# Altium schematic sheet S7CAS-PLEIADES-CARTE-MERE_P06_CLOCK.SchDoc
size Tabloid; SheetNumber: 10; SheetTotal: 18; Sheet_Name: CLOCK; Size: 11x17
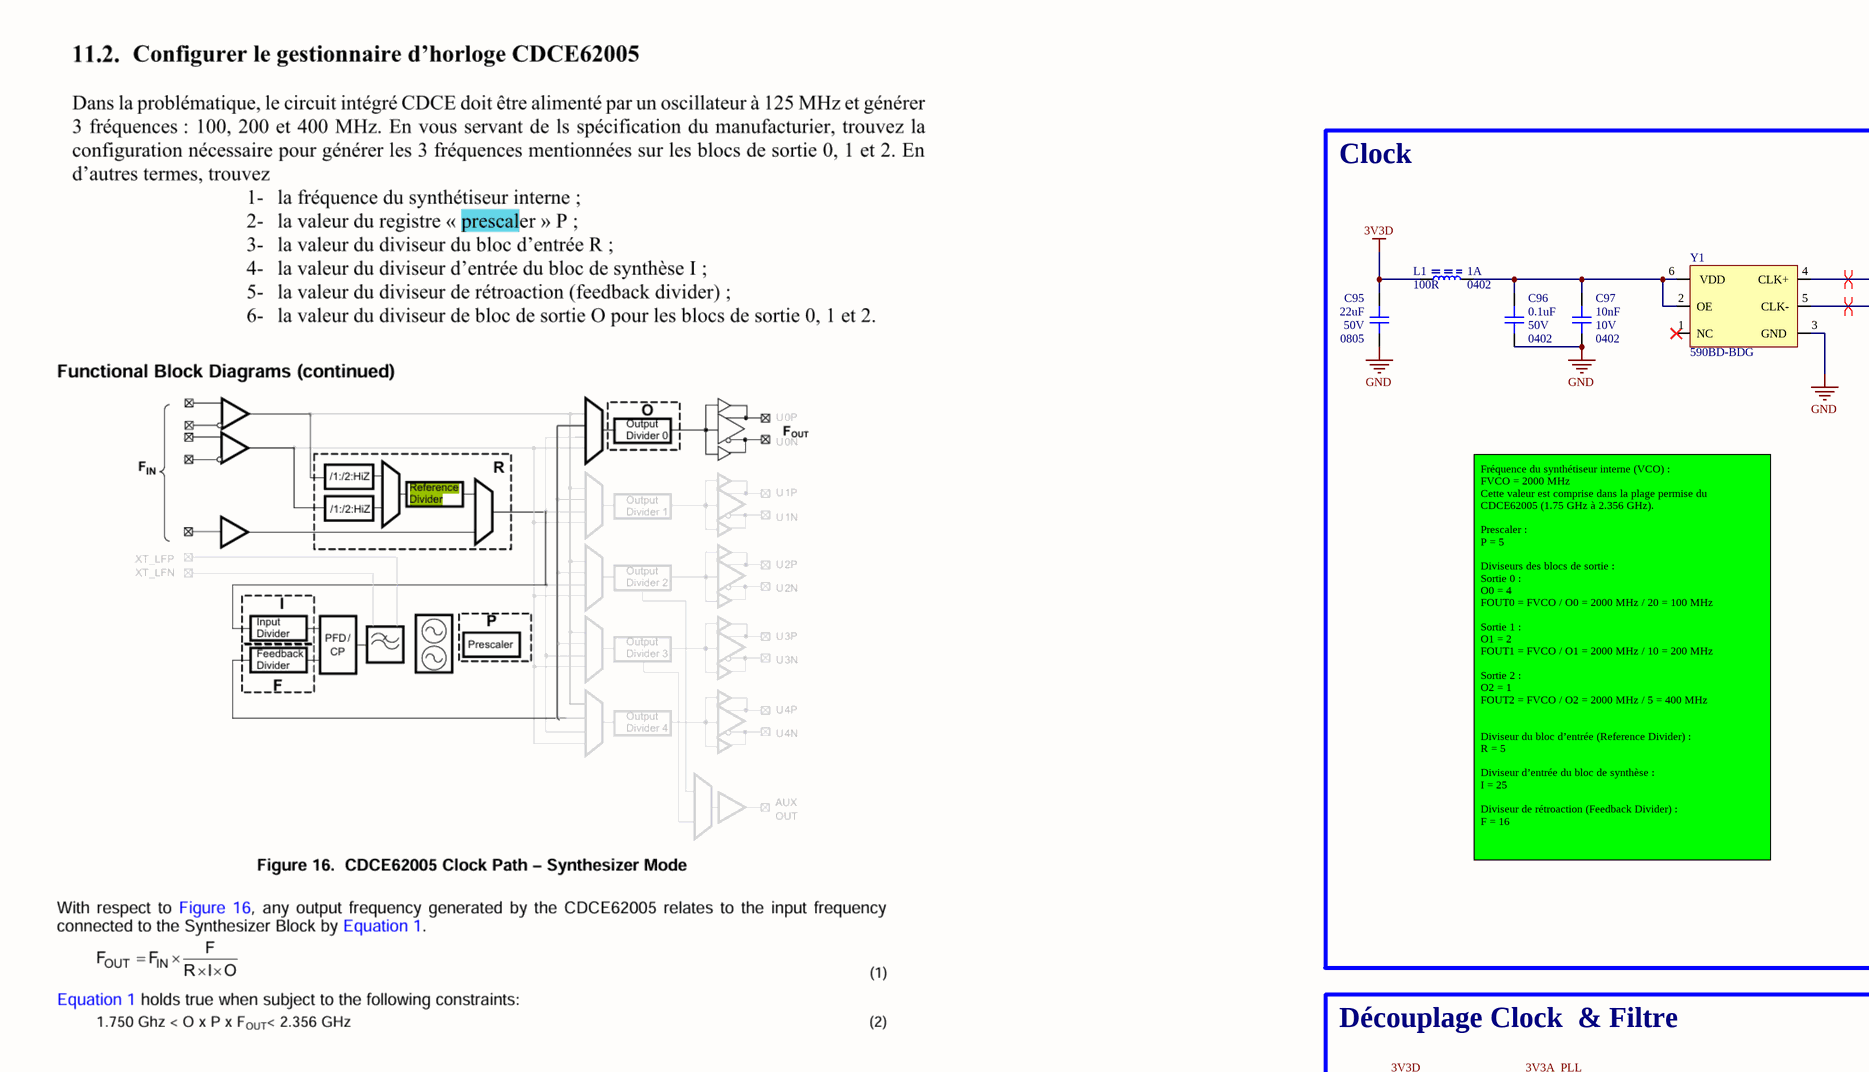
[diagram p0: S7CAS-PLEIADES-CARTE-MERE_P06_CLOCK.SchDoc, top left]
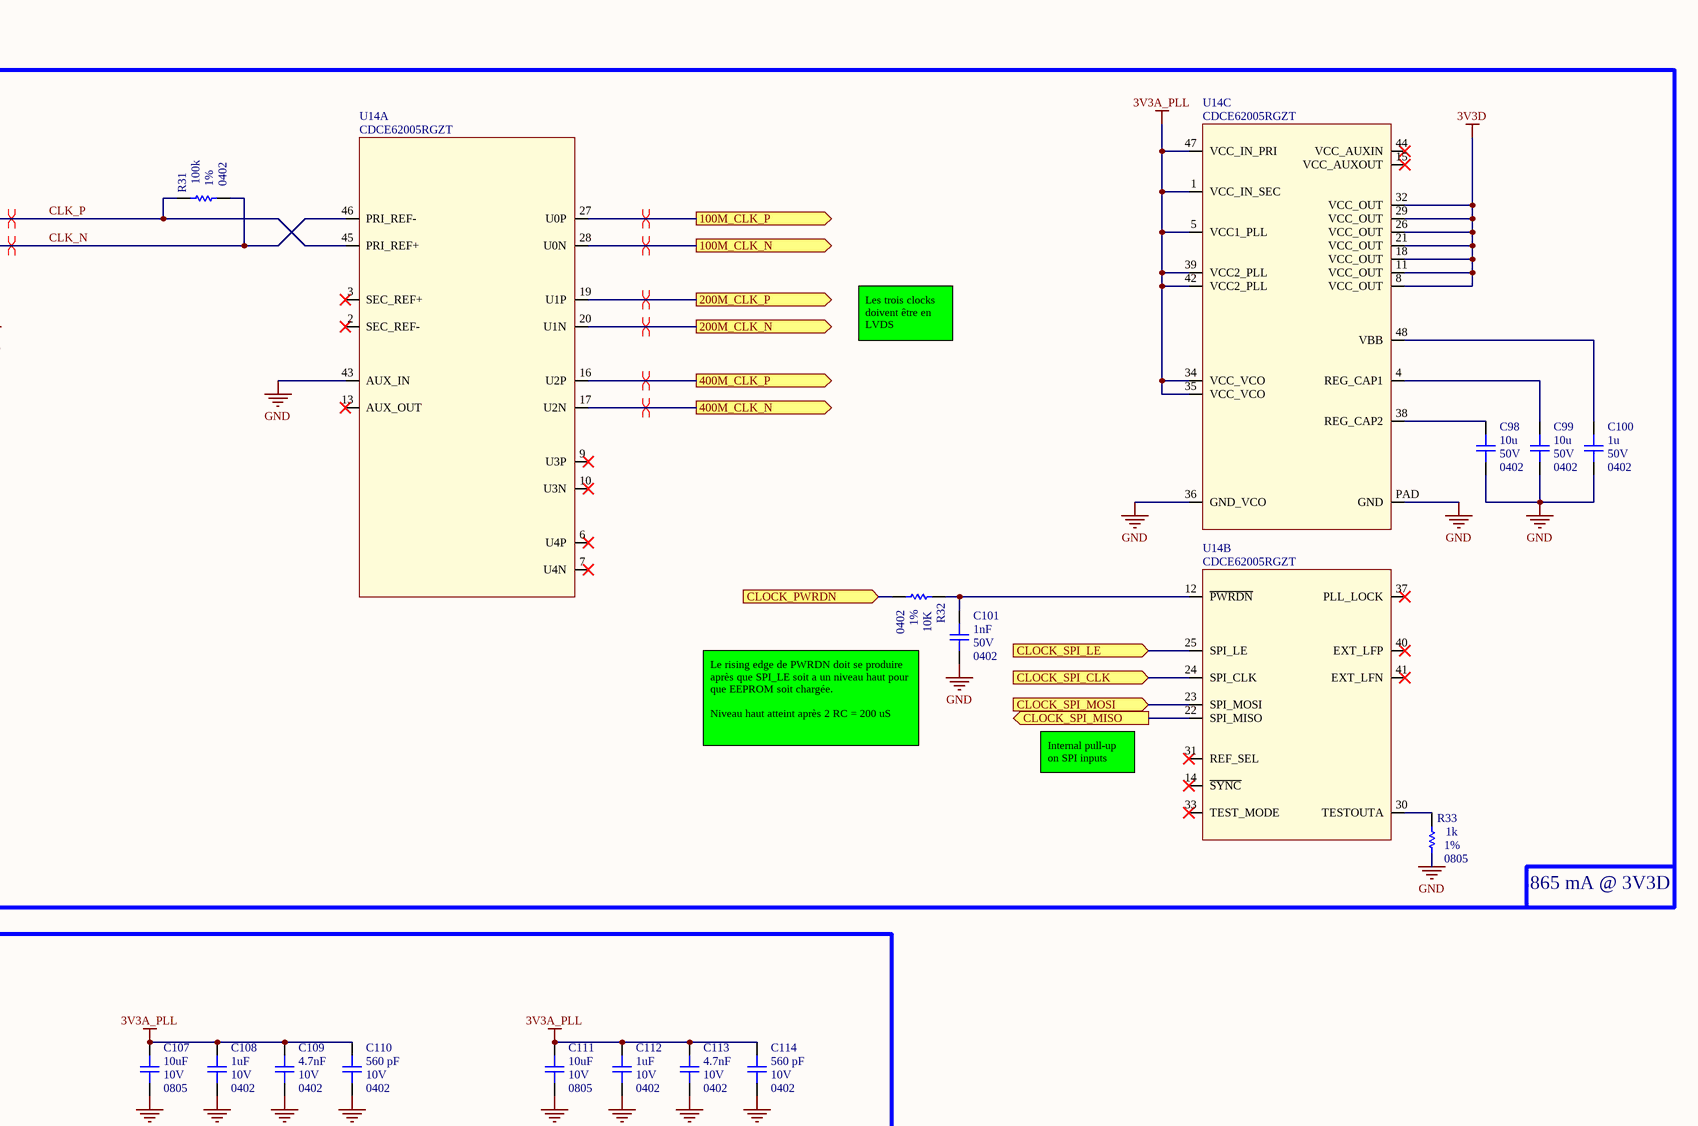
[diagram p1: S7CAS-PLEIADES-CARTE-MERE_P06_CLOCK.SchDoc, top middle]
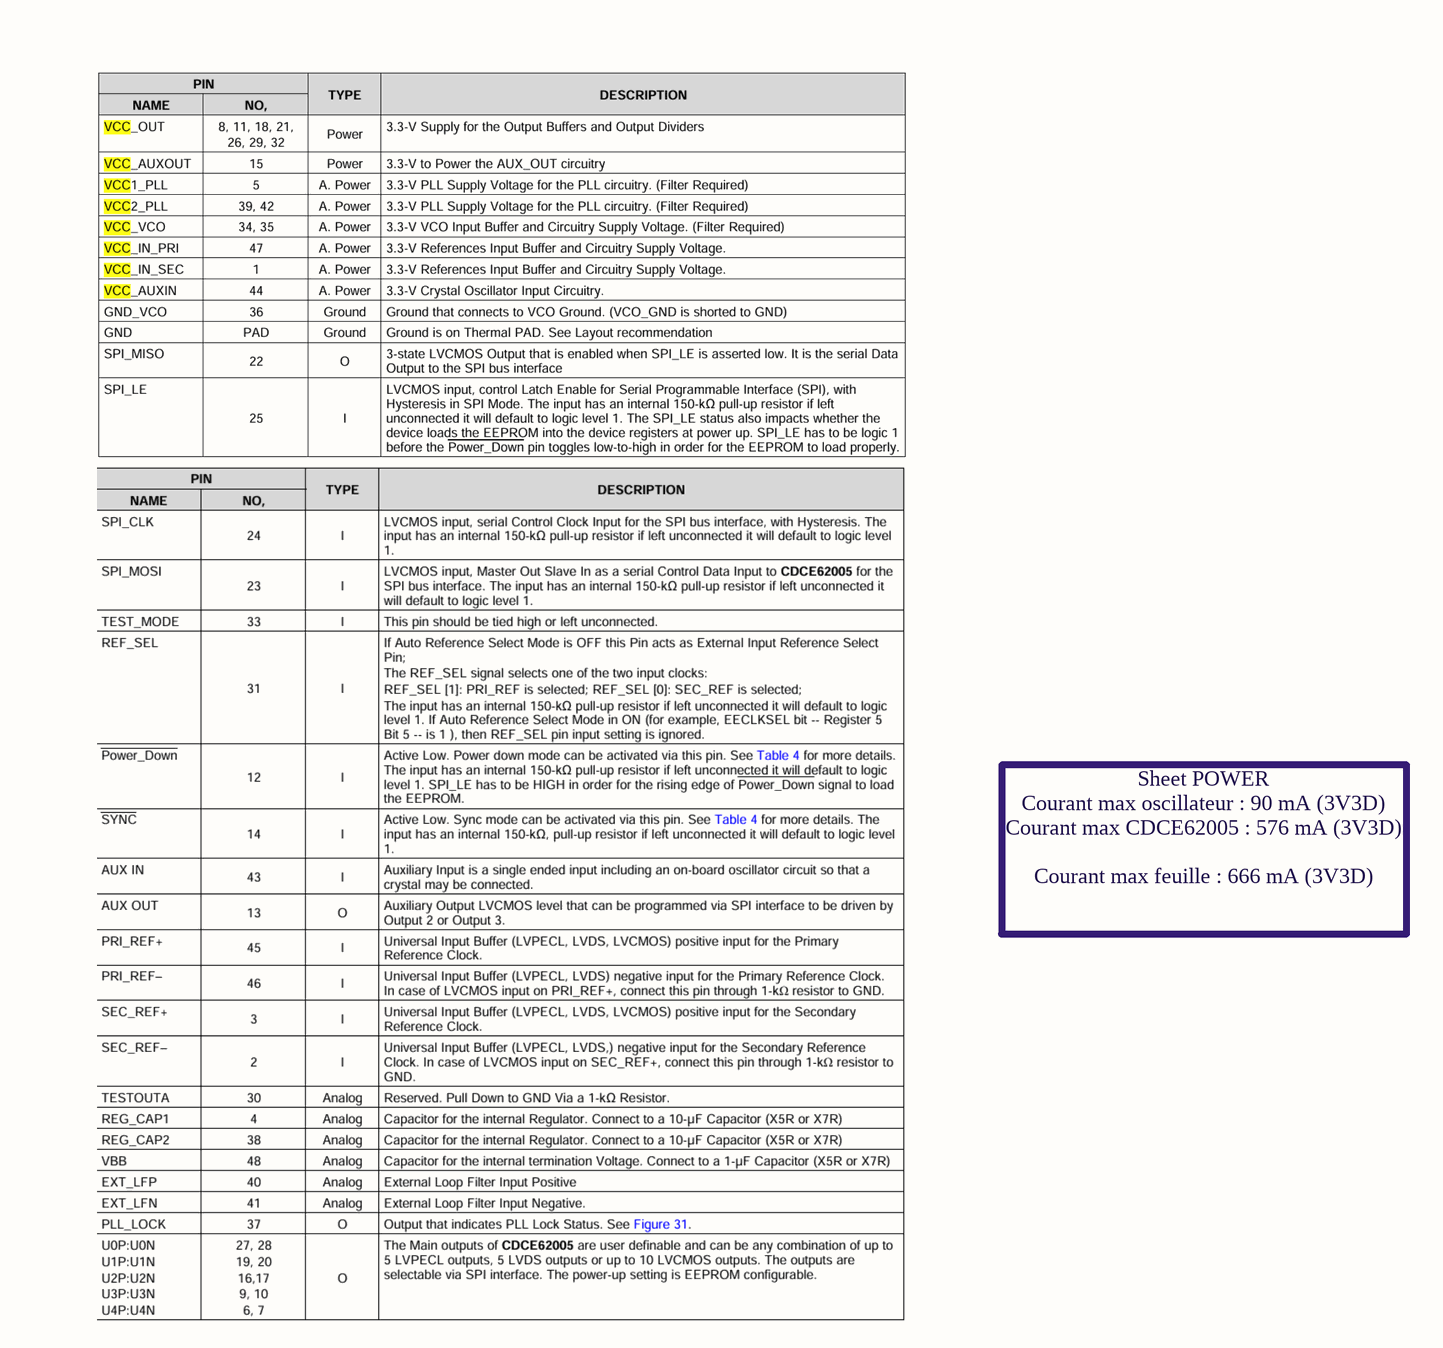
[diagram p2: S7CAS-PLEIADES-CARTE-MERE_P06_CLOCK.SchDoc, top right]
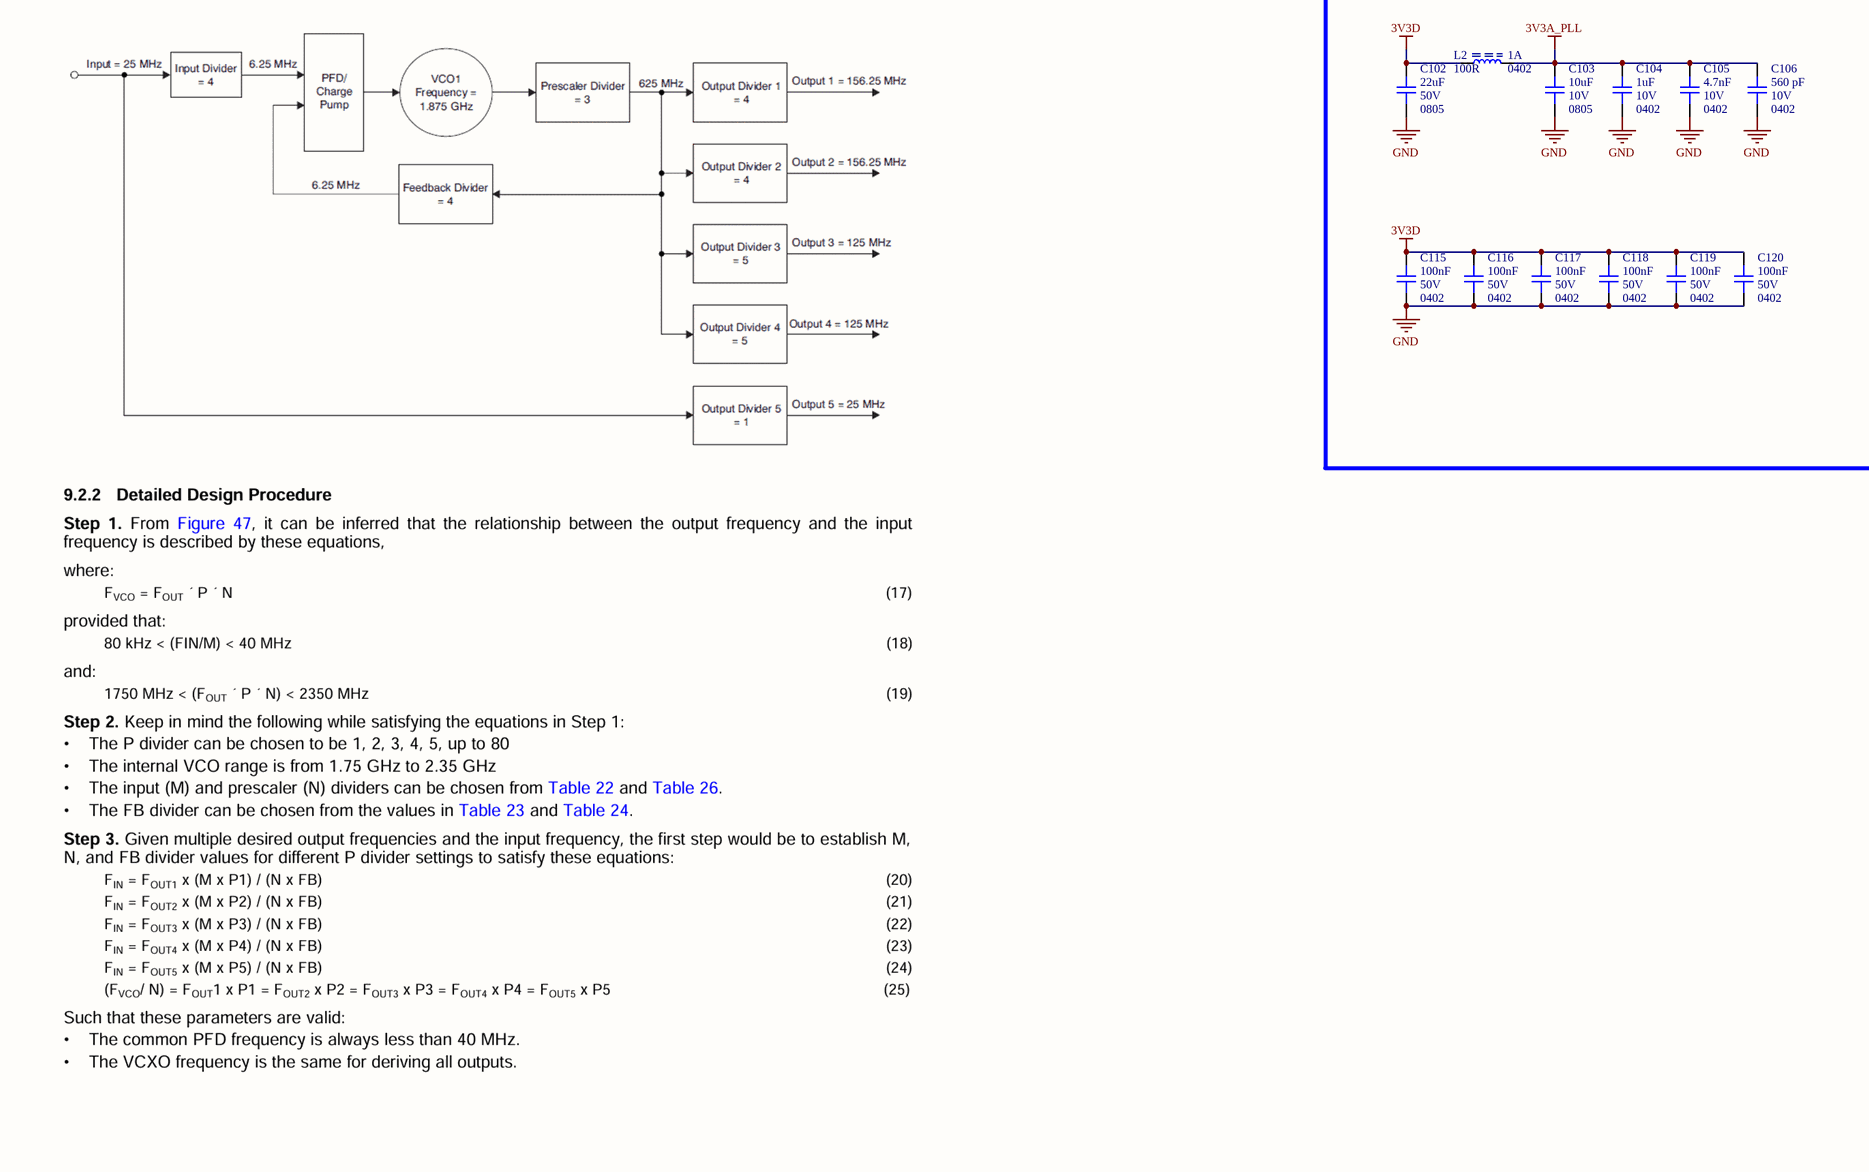
[diagram p3: S7CAS-PLEIADES-CARTE-MERE_P06_CLOCK.SchDoc, bottom left]
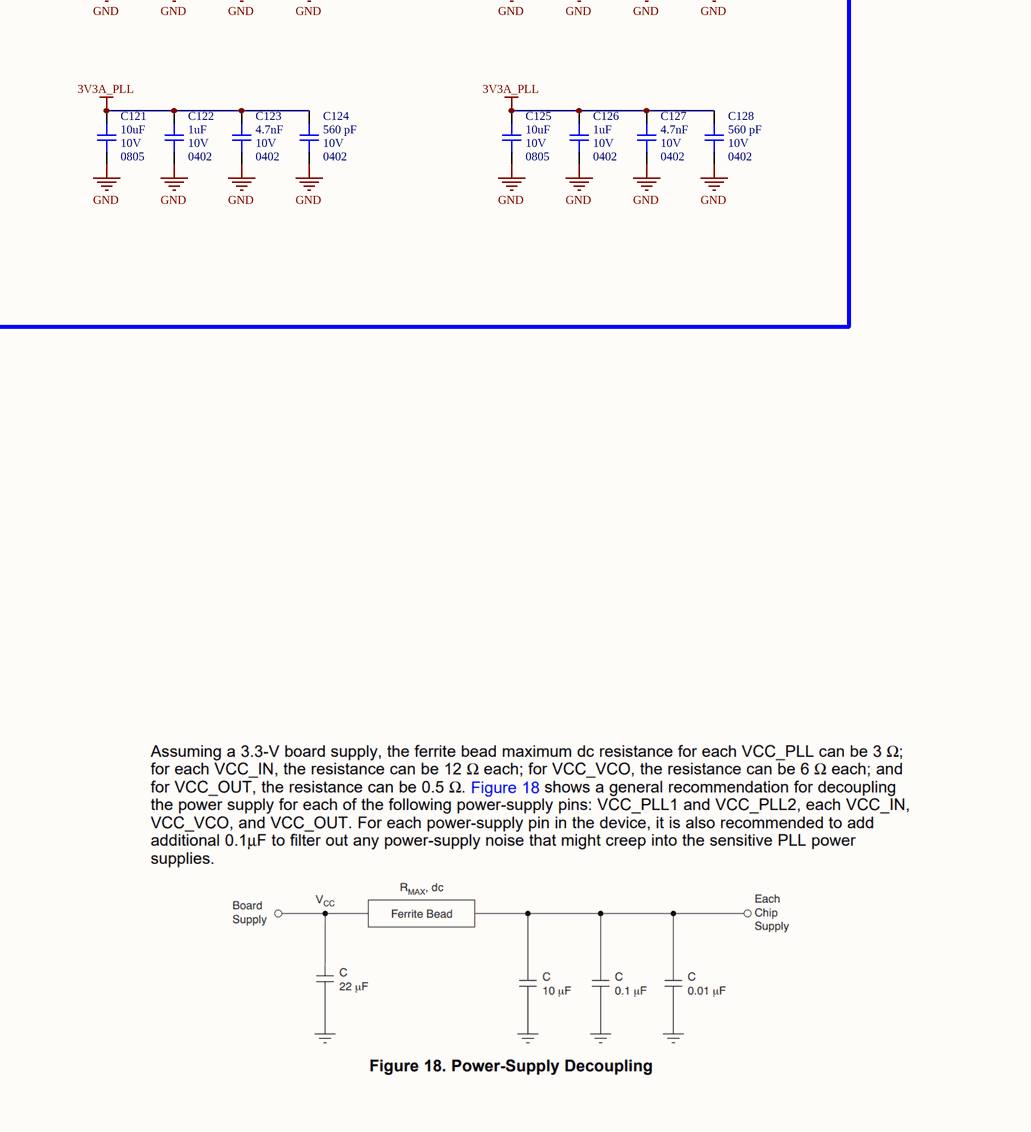
[diagram p4: S7CAS-PLEIADES-CARTE-MERE_P06_CLOCK.SchDoc, bottom middle]

## Parts
C95  value 22uF  Voltage: 50V  Package: 0805  [CAP_0805]  (hidden comment: CAP - 0805)
C96  value 0.1uF  Voltage: 50V  Package: 0402  [CAP_0402]  (hidden comment: CAP - 0402)
C97  value 10nF  Voltage: 10V  Package: 0402  [CAP_0402]  (hidden comment: CAP - 0402)
C98  value 10u  Voltage: 50V  Package: 0402  [CAP_0402]  (hidden comment: CAP - 0402)
C99  value 10u  Voltage: 50V  Package: 0402  [CAP_0402]  (hidden comment: CAP - 0402)
C100  value 1u  Voltage: 50V  Package: 0402  [CAP_0402]  (hidden comment: CAP - 0402)
C101  value 1nF  Voltage: 50V  Package: 0402  [CAP_0402]  (hidden comment: CAP - 0402)
C102  value 22uF  Voltage: 50V  Package: 0805  [CAP_0805]  (hidden comment: CAP - 0805)
C103  value 10uF  Voltage: 10V  Package: 0805  [CAP_0805]  (hidden comment: CAP - 0805)
C104  value 1uF  Voltage: 10V  Package: 0402  [CAP_0402]  (hidden comment: CAP - 0402)
C105  value 4.7nF  Voltage: 10V  Package: 0402  [CAP_0402]  (hidden comment: CAP - 0402)
C106  value 560 pF  Voltage: 10V  Package: 0402  [CAP_0402]  (hidden comment: CAP - 0402)
C107  value 10uF  Voltage: 10V  Package: 0805  [CAP_0805]  (hidden comment: CAP - 0805)
C108  value 1uF  Voltage: 10V  Package: 0402  [CAP_0402]  (hidden comment: CAP - 0402)
C109  value 4.7nF  Voltage: 10V  Package: 0402  [CAP_0402]  (hidden comment: CAP - 0402)
C110  value 560 pF  Voltage: 10V  Package: 0402  [CAP_0402]  (hidden comment: CAP - 0402)
C111  value 10uF  Voltage: 10V  Package: 0805  [CAP_0805]  (hidden comment: CAP - 0805)
C112  value 1uF  Voltage: 10V  Package: 0402  [CAP_0402]  (hidden comment: CAP - 0402)
C113  value 4.7nF  Voltage: 10V  Package: 0402  [CAP_0402]  (hidden comment: CAP - 0402)
C114  value 560 pF  Voltage: 10V  Package: 0402  [CAP_0402]  (hidden comment: CAP - 0402)
C115  value 100nF  Voltage: 50V  Package: 0402  [CAP_0402]  (hidden comment: CAP - 0402)
C116  value 100nF  Voltage: 50V  Package: 0402  [CAP_0402]  (hidden comment: CAP - 0402)
C117  value 100nF  Voltage: 50V  Package: 0402  [CAP_0402]  (hidden comment: CAP - 0402)
C118  value 100nF  Voltage: 50V  Package: 0402  [CAP_0402]  (hidden comment: CAP - 0402)
C119  value 100nF  Voltage: 50V  Package: 0402  [CAP_0402]  (hidden comment: CAP - 0402)
C120  value 100nF  Voltage: 50V  Package: 0402  [CAP_0402]  (hidden comment: CAP - 0402)
C121  value 10uF  Voltage: 10V  Package: 0805  [CAP_0805]  (hidden comment: CAP - 0805)
C122  value 1uF  Voltage: 10V  Package: 0402  [CAP_0402]  (hidden comment: CAP - 0402)
C123  value 4.7nF  Voltage: 10V  Package: 0402  [CAP_0402]  (hidden comment: CAP - 0402)
C124  value 560 pF  Voltage: 10V  Package: 0402  [CAP_0402]  (hidden comment: CAP - 0402)
C125  value 10uF  Voltage: 10V  Package: 0805  [CAP_0805]  (hidden comment: CAP - 0805)
C126  value 1uF  Voltage: 10V  Package: 0402  [CAP_0402]  (hidden comment: CAP - 0402)
C127  value 4.7nF  Voltage: 10V  Package: 0402  [CAP_0402]  (hidden comment: CAP - 0402)
C128  value 560 pF  Voltage: 10V  Package: 0402  [CAP_0402]  (hidden comment: CAP - 0402)
L1  value 100R  Current: 1A  Package: 0402  [FER_0402]  (hidden comment: FER - 0402)
L2  value 100R  Current: 1A  Package: 0402  [FER_0402]  (hidden comment: FER - 0402)
R31  value 100k  Package: 0402  Precision: 1%  [RES_0402]  (hidden comment: RES - 0402)
R32  value 10K  Package: 0402  Precision: 1%  [RES_0402]  (hidden comment: RES - 0402)
R33  value 1k  Package: 0805  Precision: 1%  [RES_0805]  (hidden comment: RES - 0805)
U14  CDCE62005RGZT  [TIM_CDCE62005RGZT]  (parts A,B,C of 3)
Y1  590BD-BDG  [OSC_590BD-BDG]

## Blocks framed on the sheet
Clock: C95-C101 L1 R31-R33 U14 Y1
Découplage Clock  & Filtre: C102-C128 L2

## Ports
100M_CLK_N (out, see S7CAS-PLEIADES-CARTE-MERE_P06_FPGA1[1C]), 100M_CLK_P (out, see S7CAS-PLEIADES-CARTE-MERE_P06_FPGA1[1C]), 200M_CLK_N (out, see S7CAS-PLEIADES-CARTE-MERE_P06_ADC[5A]), 200M_CLK_P (out, see S7CAS-PLEIADES-CARTE-MERE_P06_ADC[5A]), 400M_CLK_N (out, see S7CAS-PLEIADES-CARTE-MERE_P06_DAC[5B]), 400M_CLK_P (out, see S7CAS-PLEIADES-CARTE-MERE_P06_DAC[5B]), CLOCK_PWRDN (in, see S7CAS-PLEIADES-CARTE-MERE_P06_FPGA2[1A]), CLOCK_SPI_CLK (in, see S7CAS-PLEIADES-CARTE-MERE_P06_FPGA2[1B]), CLOCK_SPI_LE (in, see S7CAS-PLEIADES-CARTE-MERE_P06_FPGA2[1A]), CLOCK_SPI_MISO (out, see S7CAS-PLEIADES-CARTE-MERE_P06_FPGA2[1B]), CLOCK_SPI_MOSI (in, see S7CAS-PLEIADES-CARTE-MERE_P06_FPGA2[1B])

## Nets
3V3A_PLL: C103.2 C104.2 C105.2 C106.2 C107.2 C108.2 C109.2 C110.2 C111.2 C112.2 C113.2 C114.2 C121.2 C122.2 C123.2 C124.2 C125.2 C126.2 C127.2 C128.2 L2.1 U14.1(VCC_IN_SEC) U14.5(VCC1_PLL) U14.34(VCC_VCO) U14.35(VCC_VCO) U14.39(VCC2_PLL) U14.42(VCC2_PLL) U14.47(VCC_IN_PRI)
3V3D: C95.2 C102.2 C115.2 C116.2 C117.2 C118.2 C119.2 C120.2 L1.2 L2.2 U14.8(VCC_OUT) U14.11(VCC_OUT) U14.18(VCC_OUT) U14.21(VCC_OUT) U14.26(VCC_OUT) U14.29(VCC_OUT) U14.32(VCC_OUT)
GND: C95.1 C96.1 C97.1 C98.1 C99.1 C100.1 C101.1 C102.1 C103.1 C104.1 C105.1 C106.1 C107.1 C108.1 C109.1 C110.1 C111.1 C112.1 C113.1 C114.1 C115.1 C116.1 C117.1 C118.1 C119.1 C120.1 C121.1 C122.1 C123.1 C124.1 C125.1 C126.1 C127.1 C128.1 R33.1 U14.36(GND_VCO) U14.43(AUX_IN) U14.PAD(GND) Y1.3(GND)
100M_CLK_N: U14.28(U0N) ; port 100M_CLK_N
100M_CLK_P: U14.27(U0P) ; port 100M_CLK_P
200M_CLK_N: U14.20(U1N) ; port 200M_CLK_N
200M_CLK_P: U14.19(U1P) ; port 200M_CLK_P
400M_CLK_N: U14.17(U2N) ; port 400M_CLK_N
400M_CLK_P: U14.16(U2P) ; port 400M_CLK_P
CLK_N: R31.1 U14.46(PRI_REF-) Y1.5(CLK-)
CLK_P: R31.2 U14.45(PRI_REF+) Y1.4(CLK+)
CLOCK_PWRDN: R32.1 ; port CLOCK_PWRDN
CLOCK_SPI_CLK: U14.24(SPI_CLK) ; port CLOCK_SPI_CLK
CLOCK_SPI_LE: U14.25(SPI_LE) ; port CLOCK_SPI_LE
CLOCK_SPI_MISO: U14.22(SPI_MISO) ; port CLOCK_SPI_MISO
CLOCK_SPI_MOSI: U14.23(SPI_MOSI) ; port CLOCK_SPI_MOSI
NetC96_2: C96.2 C97.2 L1.1 Y1.2(OE) Y1.6(VDD)
NetC98_2: C98.2 U14.38(REG_CAP2)
NetC99_2: C99.2 U14.4(REG_CAP1)
NetC100_2: C100.2 U14.48(VBB)
NetC101_2: C101.2 R32.2 U14.12(~{PWRDN})
NetR33_2: R33.2 U14.30(TESTOUTA)

Not connected (* = marked no-connect by the designer): U14 2(SEC_REF-)* 3(SEC_REF+)* 6(U4P)* 7(U4N)* 9(U3P)* 10(U3N)* 13(AUX_OUT)* 14(~{SYNC})* 15(VCC_AUXOUT)* 31(REF_SEL)* 33(TEST_MODE)* 37(PLL_LOCK)* 40(EXT_LFP)* 41(EXT_LFN)* 44(VCC_AUXIN)*; Y1 1(NC)*

## Layout directives
differential pair: 100M_CLK_N, 100M_CLK_P, 200M_CLK_N, 200M_CLK_P, 400M_CLK_N, 400M_CLK_P, CLK_N, CLK_P

## Notes on the sheet
- Les trois clocks doivent être en LVDS
- Le rising edge de PWRDN doit se produire après que SPI_LE soit a un niveau haut pour que EEPROM soit chargée.
  Niveau haut atteint après 2 RC = 200 uS
- Internal pull-up on SPI inputs
- Fréquence du synthétiseur interne (VCO) :
  FVCO = 2000 MHz
  Cette valeur est comprise dans la plage permise du CDCE62005 (1.75 GHz à 2.356 GHz).
  Prescaler :
  P = 5
  Diviseurs des blocs de sortie :
  Sortie 0 :
  O0 = 4
  FOUT0 = FVCO / O0 = 2000 MHz / 20 = 100 MHz
  Sortie 1 :
  O1 = 2
  FOUT1 = FVCO / O1 = 2000 MHz / 10 = 200 MHz
  Sortie 2 :
  O2 = 1
  FOUT2 = FVCO / O2 = 2000 MHz / 5 = 400 MHz
  Diviseur du bloc d’entrée (Reference Divider) :
  R = 5
  Diviseur d’entrée du bloc de synthèse :
  I = 25
  Diviseur de rétroaction (Feedback Divider) :
  F = 16
- 865 mA @ 3V3D
- Sheet POWER
  Courant max oscillateur : 90 mA (3V3D)
  Courant max CDCE62005 : 576 mA (3V3D)
  Courant max feuille : 666 mA (3V3D)
- Sheet Name
- Project Title
- Global Project
- Size
- Group
- Revision
- Date
- Sheet
- of
- Filename
- Designers

## Library data of the parts
C95 C102 C103 C107 C111 C121 C125 = CAP - 0805: Precision: 10%; Current: *; CreatedBy: Jonathan Bouchard; Power: *
C96-C101 C104-C106 C108-C110 C112-C120 C122-C124 C126-C128 = CAP - 0402: Precision: 10%; Current: *; CreatedBy: Jonathan Bouchard; Power: *
R31 R32 = RES - 0402: Voltage: 50V; Power: 1/16W; Current: *; CreatedBy: Jonathan Bouchard
U14 = TIM_CDCE62005RGZT: TIM - CLK SYNTH JITTER CLEANER 3:5 - QFN-48; Voltage: 3 V ~ 3.6 V; Mfg: Texas Instruments; Current: *; Power: *; Mfg Part Number: CDCE62005RGZT; HelpURL: http://www.ti.com/lit/ds/symlink/cdce62005.pdf; CreatedBy: Jonathan Bouchard; Temperature: -40°C ~ 85°C; Value: *; Precision: *; Package: QFN-48; Supplier 1: Digikey; Supplier Part Number 1: 296-23947-1-ND
Y1 = OSC_590BD-BDG: TIM - OSC PROG 125MHz ~ 214.999MHz LVDS 3.3V 7PPM EN/DS - 6-SMD; Manufacturer #1: Silicon Labs; Current Rating: 100 mA (supply); Note: Spécifié la fréquence lors de la commande; Voltage rating: 3.3V (supply); Polarized: Yes; Value: ±7ppm (freq Stability), ±20ppm (freq stability total); Magnetic Material: UNKNOWN; GRAMS Lib Spec: 2.8; Manufacturer #2: *; Power Max: *; Part Number #1: 590BD-BDG; Part Number #2: *; HelpURL: https://www.silabs.com/documents/public/data-sheets/Si590-591.pdf; Supplier 1: Digi-Key; Supplier Part Number 1: 590BD-BDG-ND; Assembly Type: SMD; Temperature: -40°C ~ 85°C; Package: 6-SMD; CreatedBy/Date: from 590BD-CDG; Tolerance: *; VerifiedBy: Caroline Paulin / 3/10/2019; Cryo: UNKNOWN
L1 L2 = FER - 0402: Voltage: *; CreatedBy: Jonathan Bouchard; Power: *; Precision: *
R33 = RES - 0805: Current: *; CreatedBy: Jonathan Bouchard